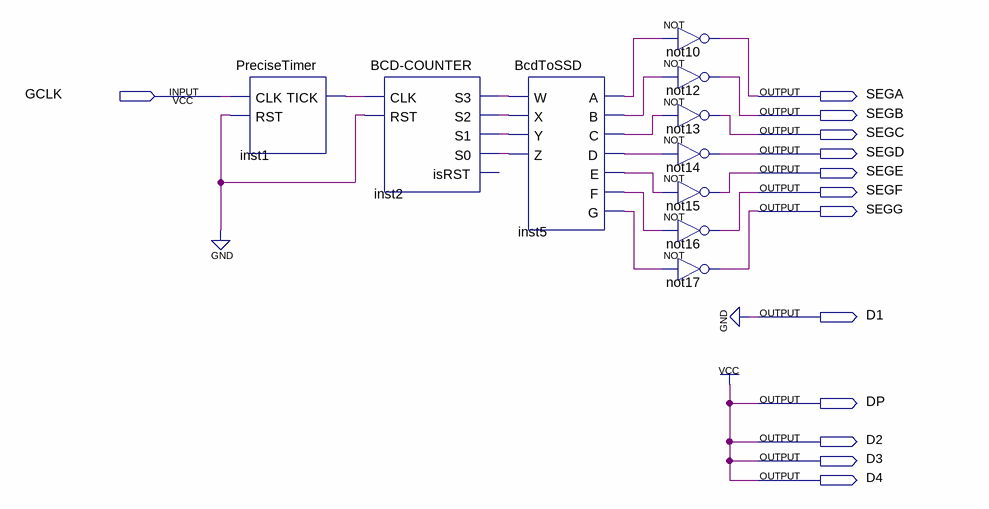
[diagram p0: schematic sheet]
// Quartus schematic Controller.bdf as structural Verilog: 10 symbols, 13 pins
module Controller (
  input  GCLK,
  output SEGA,
  output SEGB,
  output SEGC,
  output SEGD,
  output SEGE,
  output SEGF,
  output SEGG,
  output D1,
  output DP,
  output D2,
  output D3,
  output D4
);

  wire inst1_tick, inst2_s0, inst2_s1, inst2_s2, inst2_s3, inst5_a, inst5_b, inst5_c, inst5_d, inst5_e,
       inst5_f, inst5_g;

  PreciseTimer inst1 (.CLK(GCLK), .RST(1'b0), .TICK(inst1_tick));
  \BCD-COUNTER  inst2 (
    .CLK(inst1_tick), .RST(1'b0), .S3(inst2_s3), .S2(inst2_s2), .S1(inst2_s1), .S0(inst2_s0));  // open: isRST
  BcdToSSD inst5 (
    .W(inst2_s3), .X(inst2_s2), .Y(inst2_s1), .Z(inst2_s0), .A(inst5_a), .B(inst5_b), .C(inst5_c),
    .D(inst5_d), .E(inst5_e), .F(inst5_f), .G(inst5_g));
  not not10 (SEGA, inst5_a);
  not not12 (SEGB, inst5_b);
  not not13 (SEGC, inst5_c);
  not not14 (SEGD, inst5_d);
  not not15 (SEGE, inst5_e);
  not not16 (SEGF, inst5_f);
  not not17 (SEGG, inst5_g);

  assign D1 = 1'b0;
  assign D2 = 1'b1;
  assign D3 = 1'b1;
  assign D4 = 1'b1;
  assign DP = 1'b1;
endmodule
